# Altium project BugBuster.PrjPcb (part 1 of 4)
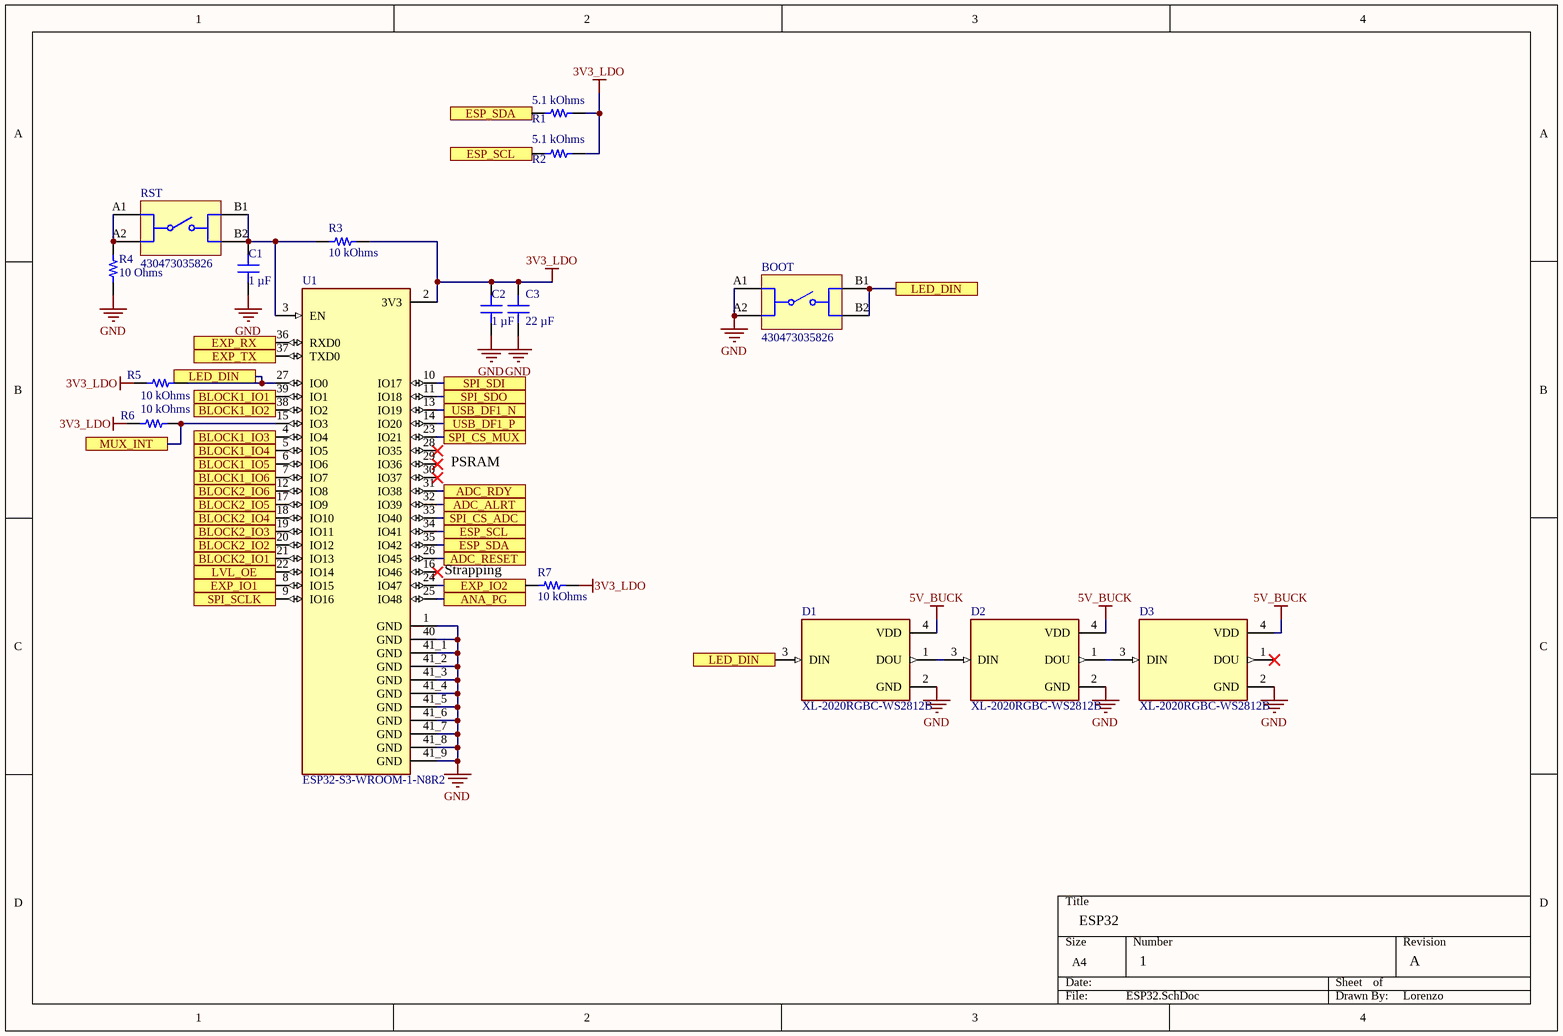
[diagram p0: ESP32.SchDoc]
5 sheets, 244 parts. Net scope: flat (ports and power ports of the same name join across sheets).
Board file: BugBusterMain.PcbDoc
Sheets:
  ESP32.SchDoc
  USB.SchDoc
  Power.SchDoc
  Analog.SchDoc
  IOs.SchDoc

## Sheet ESP32.SchDoc
size A4; SheetNumber: 1; SheetTotal: 5

### Parts
BOOT  430473035826  [430473035826]
C1  1 µF  [CAP 0603_1608]
C2  1 µF  [CAP 0603_1608]
C3  22 µF  [CAP 0603_1608]
D1  XL-2020RGBC-WS2812B  [LED_XL-2020RGBC-WS2812B]
D2  XL-2020RGBC-WS2812B  [LED_XL-2020RGBC-WS2812B]
D3  XL-2020RGBC-WS2812B  [LED_XL-2020RGBC-WS2812B]
R1  5.1 kOhms  [RES 0603_1608]
R2  5.1 kOhms  [RES 0603_1608]
R3  10 kOhms  [RES 0603_1608]
R4  10 Ohms  [RES 0603_1608]
R5  10 kOhms  [RES 0603_1608]
R6  10 kOhms  [RES 0603_1608]
R7  10 kOhms  [RES 0603_1608]
RST  430473035826  [430473035826]
U1  ESP32-S3-WROOM-1-N8R2  [XCVR_ESP32-S3-WROOM-1-N8R2]

### Ports
ADC_ALRT, ADC_RDY, ADC_RESET, ANA_PG, BLOCK1_IO1, BLOCK1_IO2, BLOCK1_IO3, BLOCK1_IO4, BLOCK1_IO5, BLOCK1_IO6, BLOCK2_IO1, BLOCK2_IO2, BLOCK2_IO3, BLOCK2_IO4, BLOCK2_IO5, BLOCK2_IO6, ESP_SCL, ESP_SDA, EXP_IO1, EXP_IO2, EXP_RX, EXP_TX, LED_DIN, LVL_OE, MUX_INT, SPI_CS_ADC, SPI_CS_MUX, SPI_SCLK, SPI_SDI, SPI_SDO, USB_DF1_N, USB_DF1_P

### Nets
3V3_LDO: C2.2 C3.2 R1.2 R2.2 R3.2 R5.1 R6.1 R7.1 U1.2(3V3)
5V_BUCK: D1.4(VDD) D2.4(VDD) D3.4(VDD)
GND: BOOT.A1 BOOT.A2 C1.1 C2.1 C3.1 D1.2(GND) D2.2(GND) D3.2(GND) R4.1 U1.1(GND) U1.40(GND) U1.41_1(GND) U1.41_2(GND) U1.41_3(GND) U1.41_4(GND) U1.41_5(GND) U1.41_6(GND) U1.41_7(GND) U1.41_8(GND) U1.41_9(GND)
USB_DF1_N: U1.13(IO19) ; port USB_DF1_N
USB_DF1_P: U1.14(IO20) ; port USB_DF1_P
NetBOOT_B1: BOOT.B1 BOOT.B2 D1.3(DIN) R5.2 U1.27(IO0) ; port LED_DIN
NetC1_2: C1.2 R3.1 RST.B1 RST.B2 U1.3(EN)
NetD1_1: D1.1(DOU) D2.3(DIN)
NetD2_1: D2.1(DOU) D3.3(DIN)
NetJ5_5: U1.37(TXD0) ; port EXP_TX
NetJ5_6: U1.36(RXD0) ; port EXP_RX
NetJ5_7: R7.2 U1.24(IO47) ; port EXP_IO2
NetJ5_8: U1.8(IO15) ; port EXP_IO1
NetR1_1: R1.1 U1.35(IO42) ; port ESP_SDA
NetR2_1: R2.1 U1.34(IO41) ; port ESP_SCL
NetR4_2: R4.2 RST.A1 RST.A2
NetR6_2: R6.2 U1.15(IO3) ; port MUX_INT
NetR56_2: U1.26(IO45) ; port ADC_RESET
NetR63_2: U1.31(IO38) ; port ADC_RDY
NetR64_2: U1.32(IO39) ; port ADC_ALRT
NetR96_1: U1.25(IO48) ; port ANA_PG
NetU1_4: U1.4(IO4) ; port BLOCK1_IO3
NetU1_5: U1.5(IO5) ; port BLOCK1_IO4
NetU1_6: U1.6(IO6) ; port BLOCK1_IO5
NetU1_7: U1.7(IO7) ; port BLOCK1_IO6
NetU1_9: U1.9(IO16) ; port SPI_SCLK
NetU1_10: U1.10(IO17) ; port SPI_SDI
NetU1_11: U1.11(IO18) ; port SPI_SDO
NetU1_12: U1.12(IO8) ; port BLOCK2_IO6
NetU1_17: U1.17(IO9) ; port BLOCK2_IO5
NetU1_18: U1.18(IO10) ; port BLOCK2_IO4
NetU1_19: U1.19(IO11) ; port BLOCK2_IO3
NetU1_20: U1.20(IO12) ; port BLOCK2_IO2
NetU1_21: U1.21(IO13) ; port BLOCK2_IO1
NetU1_22: U1.22(IO14) ; port LVL_OE
NetU1_23: U1.23(IO21) ; port SPI_CS_MUX
NetU1_33: U1.33(IO40) ; port SPI_CS_ADC
NetU1_38: U1.38(IO2) ; port BLOCK1_IO2
NetU1_39: U1.39(IO1) ; port BLOCK1_IO1

Not connected (* = marked no-connect by the designer): D3 1(DOU)*; U1 16(IO46)* 28(IO35)* 29(IO36)* 30(IO37)*

### Notes on the sheet
- (near U1) PSRAM
- Strapping
- ESP32
- 1
- A
- Lorenzo

### Library data of the parts
BOOT RST = CMP-1455-00006-5: Switch Tactile Spst-no 0.05A 12V; Actuator Material: Liquid Crystal Polymer, Polymer; Switch Travel: 250µm; Throw Configuration: SPST; Illumination Type: Non-Illuminated; Insulation Resistance: 100MΩ; Current Rating: 50mA; Switch Function: Off-Mom; Mechanical Life: 500kcycles; Min Operating Temperature: -40°C; Packaging: Tape and Reel; Max Operating Temperature: 85°C; Mount: Surface Mount; Contact Plating: Silver; RoHS: Compliant; Voltage Rating: 12V; Height: 3.5mm
C1 C2 = C1608X5R1H105K080AB: CAP CER 1UF 50V X5R 0603; manufacturer: TDK Corporation; Tolerance: ±10%; Part Number: C1608X5R1H105K080AB; Value: 1 µF; Applications: General Purpose; Capacitance: 1 µF; componentlink1description: Datasheet; componentlink1url: https://product.tdk.com/info/en/catalog/datasheets/mlcc_commercial_general_en.pdf?ref_disty=digikey; componentlink2description: DigiKey Link; componentlink2url: https://www.digikey.com/en/products/detail/tdk-corporation/C1608X5R1H105K080AB/2732903; Device Package: 0603 (1608 Metric); Features: Low ESL; lastupdated: 09/02/2024 20:10:02; Lifecycle Status: Active; Minimum Order: 1; Mounting Type: Surface Mount, MLCC; Operating Temperature: -55°C ~ 85°C; Package / Case: 0603 (1608 Metric); packaging: TapeAndReel; partid: 36337; Part Status: Active; price: 0.02; series: C; Size / Dimension: 0.063" L x 0.031" W (1.60mm x 0.80mm); Supplier 1: DigiKey; Supplier Part Number 1: 445-7468-1-ND; Temperature Coefficient: X5R; Thickness (Max): 0.035" (0.90mm); Voltage - Rated: 50V
C3 = CC0603MRX6S5BB226: CAP CER 22UF 6.3V X6S 0603; manufacturer: Yageo; Tolerance: ±20%; Part Number: CC0603MRX6S5BB226; Value: 22 µF; Applications: General Purpose; Capacitance: 22 µF; componentlink1description: Datasheet; componentlink1url: https://www.yageo.com/upload/media/product/productsearch/datasheet/mlcc/UPY-GPHC_X6S_4V-to-50V_5.pdf; componentlink2description: DigiKey Link; componentlink2url: https://www.digikey.com/en/products/detail/yageo/CC0603MRX6S5BB226/12698890; Device Package: 0603 (1608 Metric); lastupdated: 09/02/2024 20:09:49; Lifecycle Status: Active; Minimum Order: 1; Mounting Type: Surface Mount, MLCC; Operating Temperature: -55°C ~ 105°C; Package / Case: 0603 (1608 Metric); packaging: TapeAndReel; partid: 45941; Part Status: Active; price: 0.03; series: CC; Size / Dimension: 0.063" L x 0.031" W (1.60mm x 0.80mm); Supplier 1: DigiKey; Supplier Part Number 1: 13-CC0603MRX6S5BB226CT-ND; Temperature Coefficient: X6S; Thickness (Max): 0.039" (1.00mm); Voltage - Rated: 6.3V
D1-D3 = XL-2020RGBC-WS2812B: 2020 RGB LED(BUILT-IN IC); MF: XINGLIGHT; SnapEDA_Link: https://www.snapeda.com/parts/XL-2020RGBC-WS2812B/Xinglight/view-part/?ref=snap; Package: None; Value: *; MP: XL-2020RGBC-WS2812B; Check_prices: https://www.snapeda.com/parts/XL-2020RGBC-WS2812B/Xinglight/view-part/?ref=eda
R1 R2 = RMCF0603FT5K10: RES 5.1K OHM 1% 1/10W 0603; Manufacturer: Stackpole Electronics Inc; Power (Watts): 0.1W, 1/10W; Temperature Coefficient: ±100ppm/°C; Part Number: RMCF0603FT5K10; Value: 5.1 kOhms; ComponentLink1Description: Datasheet; ComponentLink1URL: https://www.seielect.com/catalog/sei-rmcf_rmcp.pdf; ComponentLink2Description: DigiKey Link; ComponentLink2URL: https://www.digikey.com/en/products/detail/stackpole-electronics-inc/RMCF0603FT5K10/1760908; Composition: Thick Film; Device Package: 0603 (1608 Metric); Features: Automotive AEC-Q200; Height - Seated (Max): 0.022" (0.55mm); LastUpdated: 09/02/2024 20:43:14; Lifecycle Status: Active; Minimum Order: 1; Number of Terminations: 2; Operating Temperature: -55°C ~ 155°C; Package / Case: 0603 (1608 Metric); Packaging: CutTape; PartId: 10617; Part Status: Active; Price: 0.01; Ratings: AEC-Q200; Resistance: 5.1 kOhms; Series: RMCF; Size / Dimension: 0.061" L x 0.031" W (1.55mm x 0.80mm); Supplier 1: DigiKey; Supplier Part Number 1: RMCF0603FT5K10CT-ND; Supplier Device Package: 0603; Tolerance: ±1%
R3 R5-R7 = SG73S1JTTD1002F: RES 10K OHM 1% 1/5W 0603; Manufacturer: KOA Speer Electronics, Inc.; Power (Watts): 0.2W, 1/5W; Temperature Coefficient: ±100ppm/°C; Part Number: SG73S1JTTD1002F; Value: 10 kOhms; ComponentLink1Description: Datasheet; ComponentLink1URL: http://www.koaspeer.com/catimages/Products/SG73S/SG73S.pdf; ComponentLink2Description: DigiKey Link; ComponentLink2URL: https://www.digikey.com/en/products/detail/koa-speer-electronics-inc/SG73S1JTTD1002F/10279969; Composition: Thick Film; Device Package: 0603 (1608 Metric); Features: Automotive AEC-Q200, Moisture Resistant, Pulse Withstanding; Height - Seated (Max): 0.022" (0.55mm); LastUpdated: 09/02/2024 20:43:35; Lifecycle Status: Active; Minimum Order: 1; Number of Terminations: 2; Operating Temperature: -55°C ~ 155°C; Package / Case: 0603 (1608 Metric); Packaging: TapeAndReel; PartId: 5386; Part Status: Active; Price: 0.01; Ratings: AEC-Q200; Resistance: 10 kOhms; Series: SG73S; Size / Dimension: 0.063" L x 0.031" W (1.60mm x 0.80mm); Supplier 1: DigiKey; Supplier Part Number 1: 2019-SG73S1JTTD1002FCT-ND; Supplier Device Package: 0603; Tolerance: ±1%
R4 = ESR03EZPF10R0: RES SMD 10 OHM 1% 1/4W 0603; Manufacturer: Rohm Semiconductor; Power (Watts): 0.25W, 1/4W; Temperature Coefficient: ±100ppm/°C; Part Number: ESR03EZPF10R0; Value: 10 Ohms; ComponentLink1Description: Datasheet; ComponentLink1URL: https://www.rohm.com/datasheet/ESR01MZPF/esr-e; ComponentLink2Description: DigiKey Link; ComponentLink2URL: https://www.digikey.com/en/products/detail/rohm-semiconductor/ESR03EZPF10R0/1983431; Composition: Thick Film; Device Package: 0603 (1608 Metric); Features: Automotive AEC-Q200, Pulse Withstanding; Height - Seated (Max): 0.022" (0.55mm); LastUpdated: 09/02/2024 20:43:34; Lifecycle Status: Active; Minimum Order: 1; Number of Terminations: 2; Operating Temperature: -55°C ~ 155°C; Package / Case: 0603 (1608 Metric); Packaging: TapeAndReel; PartId: 5471; Part Status: Active; Price: 0.02; Ratings: AEC-Q200; Resistance: 10 Ohms; Series: ESR; Size / Dimension: 0.063" L x 0.031" W (1.60mm x 0.80mm); Supplier 1: DigiKey; Supplier Part Number 1: RHM10.0ADCT-ND; Supplier Device Package: 0603; Tolerance: ±1%
U1 = ESP32-S3-WROOM-1-N8R2: WiFi 802.11a/b/g/n, Bluetooth v5.0 Transceiver Module 2.4GHz Antenna Not Included -; MF: Espressif Systems; Package: - Espressif Systems; Price: None; Check_prices: https://www.snapeda.com/parts/ESP32-S3-WROOM-1-N8R2/Espressif+Systems/view-part/?ref=eda; Value: *; SnapEDA_Link: https://www.snapeda.com/parts/ESP32-S3-WROOM-1-N8R2/Espressif+Systems/view-part/?ref=snap; MP: ESP32-S3-WROOM-1-N8R2; Availability: In Stock; Purchase-URL: https://pricing.snapeda.com/search?q=ESP32-S3-WROOM-1-N8R2&ref=eda

## Sheet USB.SchDoc
size A4; SheetNumber: 2; SheetTotal: 5
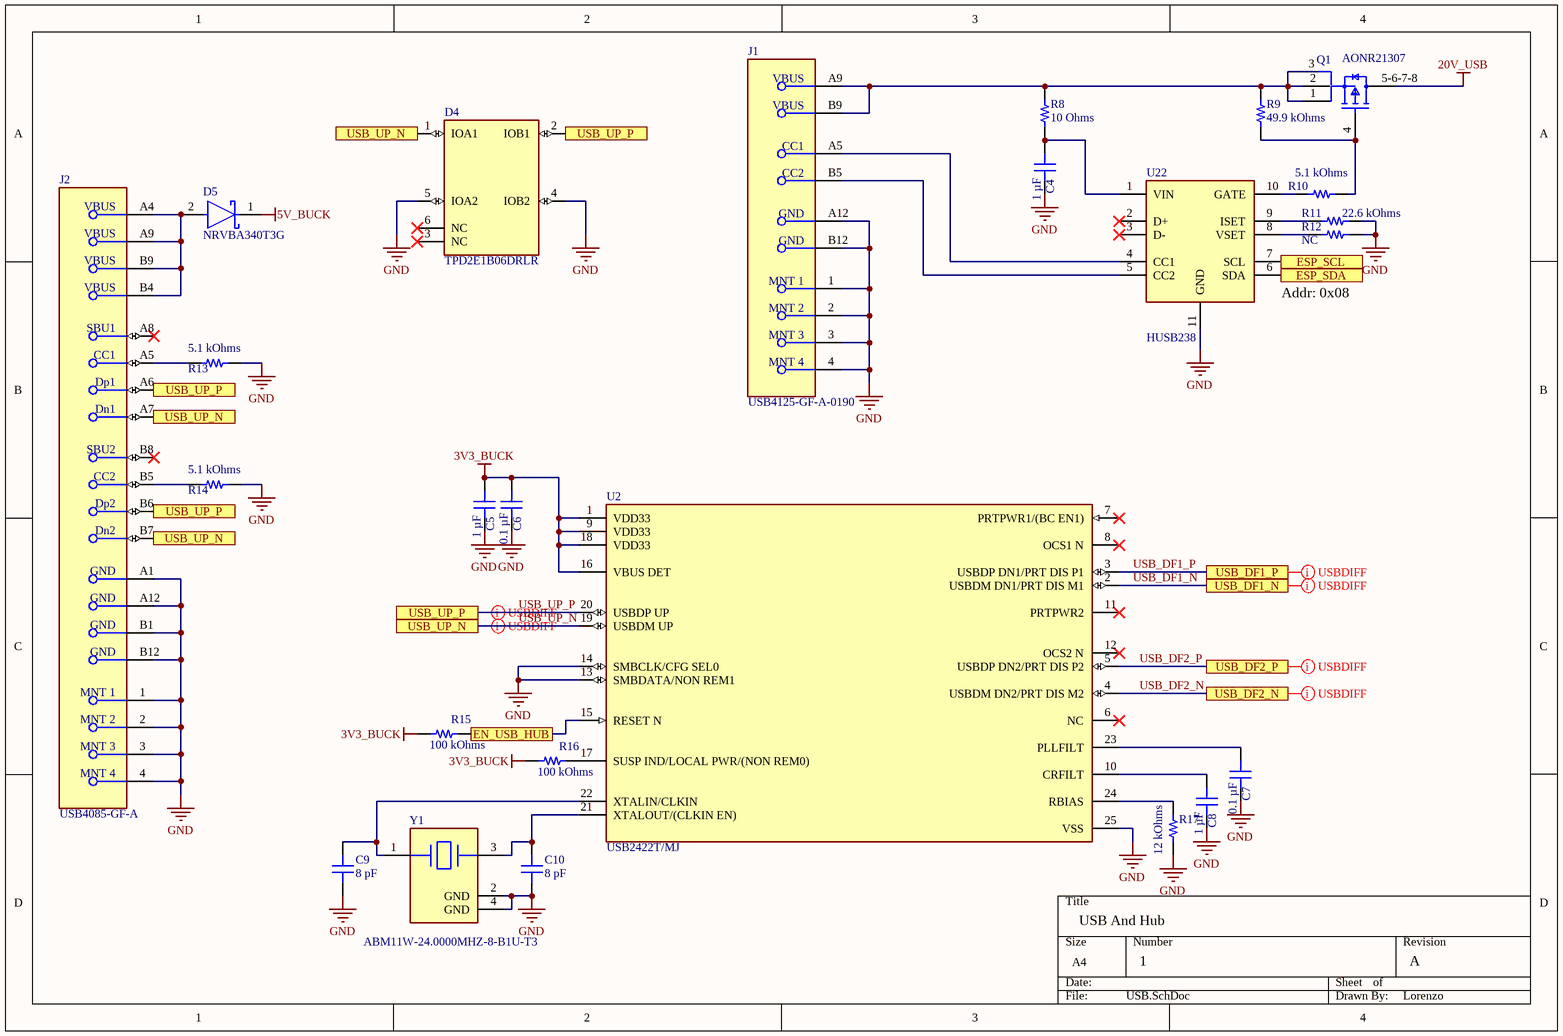
[diagram p1: USB.SchDoc]

### Parts
C4  1 µF  [CAP 0603_1608]
C5  1 µF  [CAP 0603_1608]
C6  0.1 µF  [CAP 0603_1608]
C7  0.1 µF  [CAP 0603_1608]
C8  1 µF  [CAP 0603_1608]
C9  8 pF  [CAP 0603_1608]
C10  8 pF  [CAP 0603_1608]
D4  TPD2E1B06DRLR  [FP-DRL0006A-MFG]
D5  NRVBA340T3G  [FP-403D-MFG]
J1  USB4125-GF-A-0190  [FP-USB4125-GF-A-0190-MFG]
J2  USB4085-GF-A  [FP-USB4085-GF-A-MFG]
Q1  AONR21307  [FP-DFN3x3A_8L_EP1_P-MFG]
R8  10 Ohms  [RES 0603_1608]
R9  49.9 kOhms  [RES 0603_1608]
R10  5.1 kOhms  [RES 0603_1608]
R11  22.6 kOhms  [RES 0603_1608]
R12  NC  [RES 0603_1608]
R13  5.1 kOhms  [RES 0603_1608]
R14  5.1 kOhms  [RES 0603_1608]
R15  100 kOhms  [RES 0603_1608]
R16  100 kOhms  [RES 0603_1608]
R17  12 kOhms  [RES 0603_1608]
U2  USB2422T/MJ  [FP-24-S4QFN-4x4B-0_5P-IPC_C]
U22  HUSB238  [DFN10]
Y1  ABM11W-24.0000MHZ-8-B1U-T3  [FP-ABM11W-MFG]

### Ports
EN_USB_HUB, ESP_SCL, ESP_SDA, USB_DF1_N, USB_DF1_P, USB_DF2_N, USB_DF2_P, USB_UP_N, USB_UP_P

### Nets
3V3_BUCK: C5.2 C6.2 R15.1 R16.1 U2.1(VDD33) U2.9(VDD33) U2.16(VBUS_DET) U2.18(VDD33)
5V_BUCK: D5.1(C)
20V_USB: Q1.5-6-7-8(D)
GND: C4.1 C5.1 C6.1 C7.1 C8.1 C9.1 C10.1 D4.4(IOB2) D4.5(IOA2) J1.1(MNT_1) J1.2(MNT_2) J1.3(MNT_3) J1.4(MNT_4) J1.A12(GND) J1.B12(GND) J2.1(MNT_1) J2.2(MNT_2) J2.3(MNT_3) J2.4(MNT_4) J2.A1(GND) J2.A12(GND) J2.B1(GND) J2.B12(GND) R11.2 R12.2 R13.2 R14.2 R17.1 U2.13(SMBDATA/NON_REM1) U2.14(SMBCLK/CFG_SEL0) U2.25(VSS) U22.11(GND) Y1.2(GND) Y1.4(GND)
USB_DF1_N: U2.2(USBDM_DN1/PRT_DIS_M1) ; port USB_DF1_N
USB_DF1_P: U2.3(USBDP_DN1/PRT_DIS_P1) ; port USB_DF1_P
USB_DF2_N: U2.4(USBDM_DN2/PRT_DIS_M2) ; port USB_DF2_N
USB_DF2_P: U2.5(USBDP_DN2/PRT_DIS_P2) ; port USB_DF2_P
USB_UP_N: D4.1(IOA1) J2.A7(Dn1) J2.B7(Dn2) U2.19(USBDM_UP) ; port USB_UP_N
USB_UP_P: D4.2(IOB1) J2.A6(Dp1) J2.B6(Dp2) U2.20(USBDP_UP) ; port USB_UP_P
NetC4_2: C4.2 R8.1 U22.1(VIN)
NetC7_2: C7.2 U2.23(PLLFILT)
NetC8_2: C8.2 U2.10(CRFILT)
NetC9_2: C9.2 U2.22(XTALIN/CLKIN) Y1.1
NetC10_2: C10.2 U2.21(XTALOUT/(CLKIN_EN)) Y1.3
NetD5_2: D5.2(A) J2.A4(VBUS) J2.A9(VBUS) J2.B4(VBUS) J2.B9(VBUS)
NetJ1_A5: J1.A5(CC1) U22.4(CC1)
NetJ1_A9: J1.A9(VBUS) J1.B9(VBUS) Q1.1(S) Q1.2(S) Q1.3(S) R8.2 R9.2
NetJ1_B5: J1.B5(CC2) U22.5(CC2)
NetJ2_A5: J2.A5(CC1) R13.1
NetJ2_B5: J2.B5(CC2) R14.1
NetQ1_4: Q1.4(G) R9.1 R10.2
NetR1_1: U22.6(SDA) ; port ESP_SDA
NetR2_1: U22.7(SCL) ; port ESP_SCL
NetR10_1: R10.1 U22.10(GATE)
NetR11_1: R11.1 U22.9(ISET)
NetR12_1: R12.1 U22.8(VSET)
NetR15_2: R15.2 U2.15(RESET_N) ; port EN_USB_HUB
NetR16_2: R16.2 U2.17(SUSP_IND/LOCAL_PWR/(NON_REM0))
NetR17_2: R17.2 U2.24(RBIAS)

Not connected (* = marked no-connect by the designer): D4 3(NC)* 6(NC)*; J2 A8(SBU1)* B8(SBU2)*; U2 6(NC)* 7(PRTPWR1/(BC_EN1))* 8(OCS1_N)* 11(PRTPWR2)* 12(OCS2_N)*; U22 2(D+)* 3(D-)*

### Layout directives
differential pair; differential pair class USBDIFF: USB_DF1_N, USB_DF1_P, USB_DF2_N, USB_DF2_P, USB_UP_N, USB_UP_P

### Notes on the sheet
- (near U22) Addr: 0x08
- USB And Hub
- 1
- A
- Lorenzo

### Library data of the parts
C4 C5 C8 = C1608X5R1H105K080AB: as C1 on sheet ESP32; Part Number: C1608X5R1H105K080AB; Value: 1 µF; Applications: General Purpose; Capacitance: 1 µF; componentlink1description: Datasheet; componentlink1url: https://product.tdk.com/info/en/catalog/datasheets/mlcc_commercial_general_en.pdf?ref_disty=digikey; componentlink2description: DigiKey Link; componentlink2url: https://www.digikey.com/en/products/detail/tdk-corporation/C1608X5R1H105K080AB/2732903; Device Package: 0603 (1608 Metric); Features: Low ESL; lastupdated: 09/02/2024 20:10:02; Lifecycle Status: Active; Minimum Order: 1; Mounting Type: Surface Mount, MLCC; Operating Temperature: -55°C ~ 85°C; Package / Case: 0603 (1608 Metric); packaging: TapeAndReel; partid: 36337; Part Status: Active; price: 0.02; series: C; Size / Dimension: 0.063" L x 0.031" W (1.60mm x 0.80mm); Supplier 1: DigiKey; Supplier Part Number 1: 445-7468-1-ND; Temperature Coefficient: X5R; Thickness (Max): 0.035" (0.90mm); Voltage - Rated: 50V
C6 C7 = CGA3E2X7R1H104M080AE: CAP CER 0.1UF 50V X7R 0603; manufacturer: TDK Corporation; Tolerance: ±20%; Part Number: CGA3E2X7R1H104M080AE; Value: 0.1 µF; Applications: Automotive, Boardflex Sensitive; Capacitance: 0.1 µF; componentlink1description: Datasheet; componentlink1url: https://product.tdk.com/info/en/catalog/datasheets/mlcc_automotive_soft_en.pdf?ref_disty=digikey; componentlink2description: DigiKey Link; componentlink2url: https://www.digikey.com/en/products/detail/tdk-corporation/CGA3E2X7R1H104M080AE/4490595; Device Package: 0603 (1608 Metric); Features: Soft Termination; lastupdated: 09/02/2024 20:10:15; Lifecycle Status: Active; Minimum Order: 1; Mounting Type: Surface Mount, MLCC; Operating Temperature: -55°C ~ 125°C; Package / Case: 0603 (1608 Metric); packaging: TapeAndReel; partid: 13634; Part Status: Active; price: 0.03; Ratings: AEC-Q200; series: CGA; Size / Dimension: 0.063" L x 0.031" W (1.60mm x 0.80mm); Supplier 1: DigiKey; Supplier Part Number 1: 445-15958-1-ND; Temperature Coefficient: X7R; Thickness (Max): 0.037" (0.95mm); Voltage - Rated: 50V
C9 C10 = CGA3E2C0G1H080D080AA: CAP CER 8PF 50V C0G 0603; manufacturer: TDK Corporation; Temperature Coefficient: C0G, NP0; Tolerance: ±0.5pF; Part Number: CGA3E2C0G1H080D080AA; Value: 8 pF; Applications: Automotive; Capacitance: 8 pF; componentlink1description: Datasheet; componentlink1url: https://product.tdk.com/info/en/catalog/datasheets/mlcc_automotive_general_en.pdf?ref_disty=digikey; componentlink2description: DigiKey Link; componentlink2url: https://www.digikey.com/en/products/detail/tdk-corporation/CGA3E2C0G1H080D080AA/2443104; Device Package: 0603 (1608 Metric); lastupdated: 09/02/2024 20:10:12; Lifecycle Status: Active; Minimum Order: 1; Mounting Type: Surface Mount, MLCC; Operating Temperature: -55°C ~ 125°C; Package / Case: 0603 (1608 Metric); packaging: TapeAndReel; partid: 15270; Part Status: Active; price: 0.01; Ratings: AEC-Q200; series: CGA; Size / Dimension: 0.063" L x 0.031" W (1.60mm x 0.80mm); Supplier 1: DigiKey; Supplier Part Number 1: 445-5626-1-ND; Thickness (Max): 0.035" (0.90mm); Voltage - Rated: 50V
D4 = CMP-04985-000003-1: TVS DIODE 5.5V 15V 6SOT; Manufacturer: Texas Instruments; Peak Pulse Power: 35W; Peak Pulse Current: 2.5A; Direction: Bidirectional; Standoff Height: 0mm; Interface: I2C,USB,LVDS,Other; Number Of Channels: 2; Breakdown Voltage: 7V; Ambient Temperature Range High: +125°C; Package: DRL0006A; Automotive: No; Lead Free: Yes; Temperature Range Low: -40°C; Reverse Standoff Voltage: 5.5V; Clamping Voltage: 15V; Mouser Description: ESD Suppressors / TVS Diodes 2-CH system level ESD protect device; Temperature Range High: +125°C; Device Class L1: Circuit Protection; ComponentLink2Description: Datasheet; RoHS: TRUE; Ambient Temperature Range Low: -40°C; Height: 0.6mm; Device Class L3: unset; Device Class L2: ESD and Circuit Protection ICs; Temperature: -40°C to +125°C; Octopart: https://octopart.com/tpd2e1b06drlr-texas+instruments-30488860; ComponentLink2URL: http://www.ti.com/lit/ds/symlink/tpd2e1b06.pdf; Category: Diode; Manufacturer Part Number: TPD2E1B06DRLR; Digikey Description: TVS DIODE 5.5V 15V 6SOT
D5 = CMP-1055-00307-2: DIODE SCHOTTKY 40V 3A SMA; Peak Non-Repetitive Surge Current: 100A; Max Reverse Current: 15mA; Forward Voltage: 450mV; Element Configuration: Single; Radiation Hardening: No; Max Operating Temperature: 150°C; Min Operating Temperature: -55°C; Package Quantity: 5000; Lead Free: Lead Free; Average Rectified Current: 3A; REACH SVHC: No SVHC; RoHS Compliant: Yes; Number of Pins: 2; Length: 4.57mm; Halogen Free: Halogen Free; Packaging: Tape and Reel; Height: 2.05mm; Max Repetitive Reverse Voltage (Vrrm): 40V; Series: -; Case/Package: SMA; Max Reverse Voltage (DC): 40V; Width: 2.92mm; Max Forward Surge Current (Ifsm): 100A; Forward Current: 3A; Weight: 0.003739oz
J1 = CMP-245163-000004-1: CONN RCPT TYPE C 6P SMD RA
J2 = CMP-196119-000001-2: CONN RCPT USB2.0 TYPE C 24POS RA; Gender: Receptacle; Number of Positions: 16; USB Standard: USB 2.0; Orientation: Right Angle; Contact Plating: Gold; Contact Material: Copper Alloy
Q1 = CMP-83955-000002-1: MOSFET P-CH 30V 3X3 DFN; Manufacturer: Alpha & Omega Semiconductor; Reverse Recovery Time: 13.3ns; Reverse Recovery Charge: 20nC; Turn Off Delay Time: 43.5ns; Max Forward Diode Voltage: -1V; Gate Charge At Vgs: 35nC @ -10V; Threshold Vgs Min: -1.3V; Gate To Source Voltage: 25V; Turn On Delay Time: 11ns; Continuous Drain Current: -24A; Power Dissipation: 5W; Max Junction Temp: +150°C; Number Of P Channels: 1; Drain To Source Voltage: -30V; Standoff Height: 0mm; Input Capacitace At Vds: 1995pF @ -15V; Depletion Mode: False; Threshold Vgs Max: -2.3V; Rthja Max: 45°C/W; Drain To Source Resistance: 9.2mΩ; Pulse Drain Current: -82A; Typ Forward Diode Voltage: -0.7V; Temperature Range Low: -55°C; Device Class L1: Discrete Semiconductors; Footprint Url: http://www.aosmd.com/res/packaging_information/DFN3x3A_8L_EP1_P.pdf; ComponentLink2Description: Datasheet; Device Class L2: Transistors; ComponentLink2URL: http://www.aosmd.com/res/data_sheets/AONR21307.pdf; Automotive: No; Temperature: -55°C to +150°C; Octopart: https://octopart.com/aonr21307-alpha+%26+omega+semiconductor-96014004; RoHS: TRUE; Digikey Description: MOSFET P-CH 30V 3X3 DFN; Drain To Source Breakdown Voltage: -30V; Package: DFN3x3A_8L_EP1_P; Manufacturer Part Number: AONR21307; Category: Trans; Height: 0.9mm; Lead Free: Yes; Device Class L3: MOSFETs; Temperature Range High: +150°C; Number Of Channels: 1
R8 = ESR03EZPF10R0: as R4 on sheet ESP32; Part Number: ESR03EZPF10R0; Value: 10 Ohms; ComponentLink1Description: Datasheet; ComponentLink1URL: https://www.rohm.com/datasheet/ESR01MZPF/esr-e; ComponentLink2Description: DigiKey Link; ComponentLink2URL: https://www.digikey.com/en/products/detail/rohm-semiconductor/ESR03EZPF10R0/1983431; Composition: Thick Film; Device Package: 0603 (1608 Metric); Features: Automotive AEC-Q200, Pulse Withstanding; Height - Seated (Max): 0.022" (0.55mm); LastUpdated: 09/02/2024 20:43:34; Lifecycle Status: Active; Minimum Order: 1; Number of Terminations: 2; Operating Temperature: -55°C ~ 155°C; Package / Case: 0603 (1608 Metric); Packaging: TapeAndReel; PartId: 5471; Part Status: Active; Price: 0.02; Ratings: AEC-Q200; Resistance: 10 Ohms; Series: ESR; Size / Dimension: 0.063" L x 0.031" W (1.60mm x 0.80mm); Supplier 1: DigiKey; Supplier Part Number 1: RHM10.0ADCT-ND; Supplier Device Package: 0603; Tolerance: ±1%
R9 = RMCF0603FT49K9: RES 49.9K OHM 1% 1/10W 0603; Manufacturer: Stackpole Electronics Inc; Power (Watts): 0.1W, 1/10W; Temperature Coefficient: ±100ppm/°C; Part Number: RMCF0603FT49K9; Value: 49.9 kOhms; ComponentLink1Description: Datasheet; ComponentLink1URL: https://www.seielect.com/catalog/sei-rmcf_rmcp.pdf; ComponentLink2Description: DigiKey Link; ComponentLink2URL: https://www.digikey.com/en/products/detail/stackpole-electronics-inc/RMCF0603FT49K9/1760907; Composition: Thick Film; Device Package: 0603 (1608 Metric); Features: Automotive AEC-Q200; Height - Seated (Max): 0.022" (0.55mm); LastUpdated: 09/02/2024 20:43:14; Lifecycle Status: Active; Minimum Order: 1; Number of Terminations: 2; Operating Temperature: -55°C ~ 155°C; Package / Case: 0603 (1608 Metric); Packaging: CutTape; PartId: 10596; Part Status: Active; Price: 0.01; Ratings: AEC-Q200; Resistance: 49.9 kOhms; Series: RMCF; Size / Dimension: 0.061" L x 0.031" W (1.55mm x 0.80mm); Supplier 1: DigiKey; Supplier Part Number 1: RMCF0603FT49K9CT-ND; Supplier Device Package: 0603; Tolerance: ±1%
R10 R13 R14 = RMCF0603FT5K10: as R1 on sheet ESP32; Part Number: RMCF0603FT5K10; Value: 5.1 kOhms; ComponentLink1Description: Datasheet; ComponentLink1URL: https://www.seielect.com/catalog/sei-rmcf_rmcp.pdf; ComponentLink2Description: DigiKey Link; ComponentLink2URL: https://www.digikey.com/en/products/detail/stackpole-electronics-inc/RMCF0603FT5K10/1760908; Composition: Thick Film; Device Package: 0603 (1608 Metric); Features: Automotive AEC-Q200; Height - Seated (Max): 0.022" (0.55mm); LastUpdated: 09/02/2024 20:43:14; Lifecycle Status: Active; Minimum Order: 1; Number of Terminations: 2; Operating Temperature: -55°C ~ 155°C; Package / Case: 0603 (1608 Metric); Packaging: CutTape; PartId: 10617; Part Status: Active; Price: 0.01; Ratings: AEC-Q200; Resistance: 5.1 kOhms; Series: RMCF; Size / Dimension: 0.061" L x 0.031" W (1.55mm x 0.80mm); Supplier 1: DigiKey; Supplier Part Number 1: RMCF0603FT5K10CT-ND; Supplier Device Package: 0603; Tolerance: ±1%
R11 = RC0603FR-0722K6L: RES 22.6K OHM 1% 1/10W 0603; Manufacturer: Yageo; Power (Watts): 0.1W, 1/10W; Temperature Coefficient: ±100ppm/°C; Part Number: RC0603FR-0722K6L; Value: 22.6 kOhms; ComponentLink1Description: Datasheet; ComponentLink1URL: https://www.yageo.com/upload/media/product/productsearch/datasheet/rchip/PYu-RC_Group_51_RoHS_L_10.pdf; ComponentLink2Description: DigiKey Link; ComponentLink2URL: https://www.digikey.com/en/products/detail/yageo/RC0603FR-0722K6L/727060; Composition: Thick Film; Device Package: 0603 (1608 Metric); Features: Moisture Resistant; Height - Seated (Max): 0.022" (0.55mm); LastUpdated: 09/02/2024 20:43:06; Lifecycle Status: Active; Minimum Order: 1; Number of Terminations: 2; Operating Temperature: -55°C ~ 155°C; Package / Case: 0603 (1608 Metric); Packaging: CutTape; PartId: 12540; Part Status: Active; Price: 0.01; Resistance: 22.6 kOhms; Series: RC_L; Size / Dimension: 0.063" L x 0.031" W (1.60mm x 0.80mm); Supplier 1: DigiKey; Supplier Part Number 1: 311-22.6KHRCT-ND; Supplier Device Package: 0603; Tolerance: ±1%
R12 = HCJ0603ZT0R00: RES 0 OHM JUMPER 1/4W 0603; Manufacturer: Stackpole Electronics Inc; Power (Watts): 0.25W, 1/4W; Resistance: 0 Ohms; Part Number: HCJ0603ZT0R00; Value: NC; ComponentLink1Description: Datasheet; ComponentLink1URL: https://www.seielect.com/catalog/sei-hcj.pdf; ComponentLink2Description: DigiKey Link; ComponentLink2URL: https://www.digikey.com/en/products/detail/stackpole-electronics-inc/HCJ0603ZT0R00/4357660; Composition: Metal Foil; Device Package: 0603 (1608 Metric); Features: Automotive AEC-Q200; Height - Seated (Max): 0.018" (0.45mm); LastUpdated: 09/02/2024 20:43:15; Lifecycle Status: Active; Minimum Order: 1; Number of Terminations: 2; Operating Temperature: -55°C ~ 155°C; Package / Case: 0603 (1608 Metric); Packaging: TapeAndReel; PartId: 10189; Part Status: Active; Price: 0.06; Ratings: AEC-Q200; Series: HCJ; Size / Dimension: 0.061" L x 0.031" W (1.55mm x 0.80mm); Supplier 1: DigiKey; Supplier Part Number 1: HCJ0603ZT0R00CT-ND; Supplier Device Package: 0603; Tolerance: Jumper
R15 R16 = SG73P1JTTD1003F: RES 100K OHM 1% 1/3W 0603; Manufacturer: KOA Speer Electronics, Inc.; Power (Watts): 0.333W, 1/3W; Temperature Coefficient: ±100ppm/°C; Part Number: SG73P1JTTD1003F; Value: 100 kOhms; ComponentLink1Description: Datasheet; ComponentLink1URL: https://www.koaspeer.com/pdfs/SG73P.pdf; ComponentLink2Description: DigiKey Link; ComponentLink2URL: https://www.digikey.com/en/products/detail/koa-speer-electronics-inc/SG73P1JTTD1003F/10188341; Composition: Thick Film; Device Package: 0603 (1608 Metric); Features: Automotive AEC-Q200, Pulse Withstanding; Height - Seated (Max): 0.022" (0.55mm); LastUpdated: 09/02/2024 20:40:28; Lifecycle Status: Active; Minimum Order: 1; Number of Terminations: 2; Operating Temperature: -55°C ~ 155°C; Package / Case: 0603 (1608 Metric); Packaging: TapeAndReel; PartId: 83707; Price: 0.01; Ratings: AEC-Q200; Resistance: 100 kOhms; Series: SG73P; Size / Dimension: 0.063" L x 0.031" W (1.60mm x 0.80mm); Supplier 1: DigiKey; Supplier Part Number 1: 2019-SG73P1JTTD1003FCT-ND; Supplier Device Package: 0603; Tolerance: ±1%
R17 = CRCW060312K0FKEAHP: RES SMD 12K OHM 1% 1/3W 0603; Manufacturer: Vishay Dale; Power (Watts): 0.333W, 1/3W; Temperature Coefficient: ±100ppm/°C; Part Number: CRCW060312K0FKEAHP; Value: 12 kOhms; ComponentLink1Description: Datasheet; ComponentLink1URL: http://www.vishay.com/docs/20043/crcwhpe3.pdf; ComponentLink2Description: DigiKey Link; ComponentLink2URL: https://www.digikey.com/en/products/detail/vishay-dale/CRCW060312K0FKEAHP/2226294; Composition: Thick Film; Device Package: 0603 (1608 Metric); Features: Automotive AEC-Q200, Pulse Withstanding; Height - Seated (Max): 0.022" (0.55mm); LastUpdated: 09/02/2024 20:43:11; Lifecycle Status: Active; Minimum Order: 1; Number of Terminations: 2; Operating Temperature: -55°C ~ 155°C; Package / Case: 0603 (1608 Metric); Packaging: TapeAndReel; PartId: 11340; Part Status: Active; Price: 0.01; Ratings: AEC-Q200; Resistance: 12 kOhms; Series: CRCW-HP; Size / Dimension: 0.063" L x 0.033" W (1.60mm x 0.85mm); Supplier 1: DigiKey; Supplier Part Number 1: 541-12.0KSCT-ND; Supplier Device Package: 0603; Tolerance: ±1%
U2 = CMP-06284-000052-1: IC HUB CTLR USB 2.0 24QFN; Number of Ports: 2; Data Rate: 480Mbps; Number of Pins: 24; Packaging: Tape and Reel; Case/Package: QFN; Series: -; RoHS Compliant: Yes; Lead Free: Lead Free; Interface: USB; Package Quantity: 5000; Max Operating Temperature: 70°C; Min Operating Temperature: 0°C
Y1 = CMP-27762-001449-1: Crystal 24MHz ±10ppm 8pF SMD-4 2mm x 1.6mm; ESR (Equivalent Series Resistance): 100R; Frequency: 24MHz; Frequency Tolerance: 10ppm; Case/Package: SMD/SMT; RoHS Compliant: Yes; Load Capacitance: 8pF; Max Operating Temperature: 70°C; Min Operating Temperature: -20°C; Frequency Stability: 10ppm; Mount: Surface Mount; Packaging: Tape and Reel